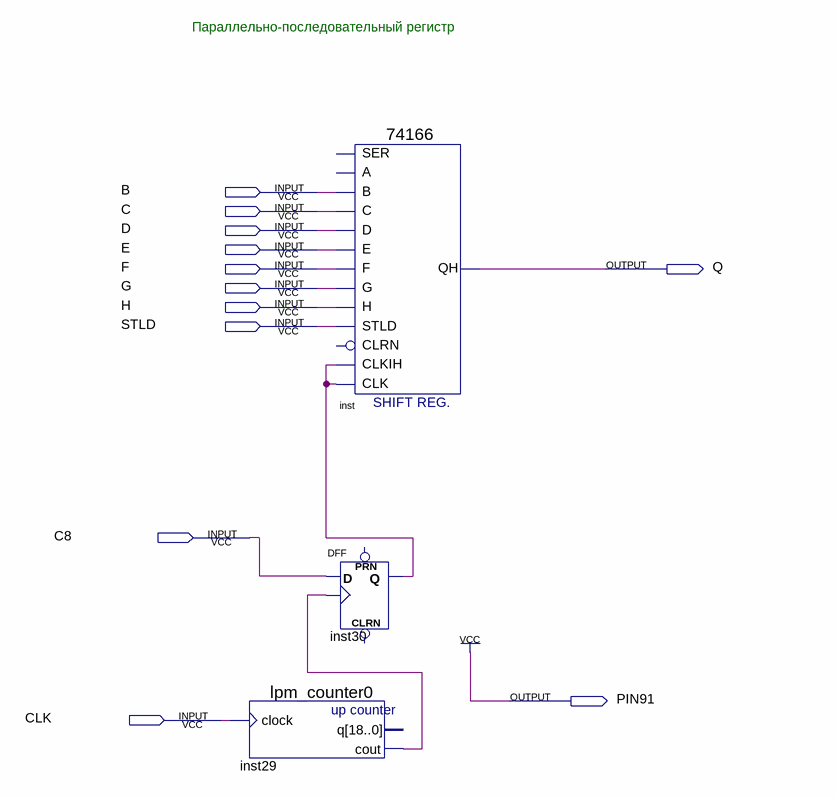
[diagram p0: schematic sheet]
// Quartus schematic Registers2.bdf as structural Verilog: 3 symbols, 12 pins
module Registers2 (
  input  B,
  input  C,
  input  D,
  input  E,
  input  F,
  input  G,
  input  H,
  input  STLD,
  input  C8,
  input  CLK,
  output Q,
  output PIN91
);

  wire inst29_cout, inst30_q;

  lpm_counter0 inst29 (.clock(CLK), .cout(inst29_cout));  // open: q
  \74166  inst (
    .C(C), .D(D), .E(E), .B(B), .STLD(STLD), .H(H), .G(G), .F(F), .CLK(inst30_q), .CLKIH(inst30_q), .QH(Q));  // open: SER, A, CLRN
  DFF inst30 (.CLK(inst29_cout), .D(C8), .Q(inst30_q));  // open: CLRN, PRN

  assign PIN91 = 1'b1;

  // Notes on the sheet:
  //   Параллельно-последовательный регистр
endmodule
